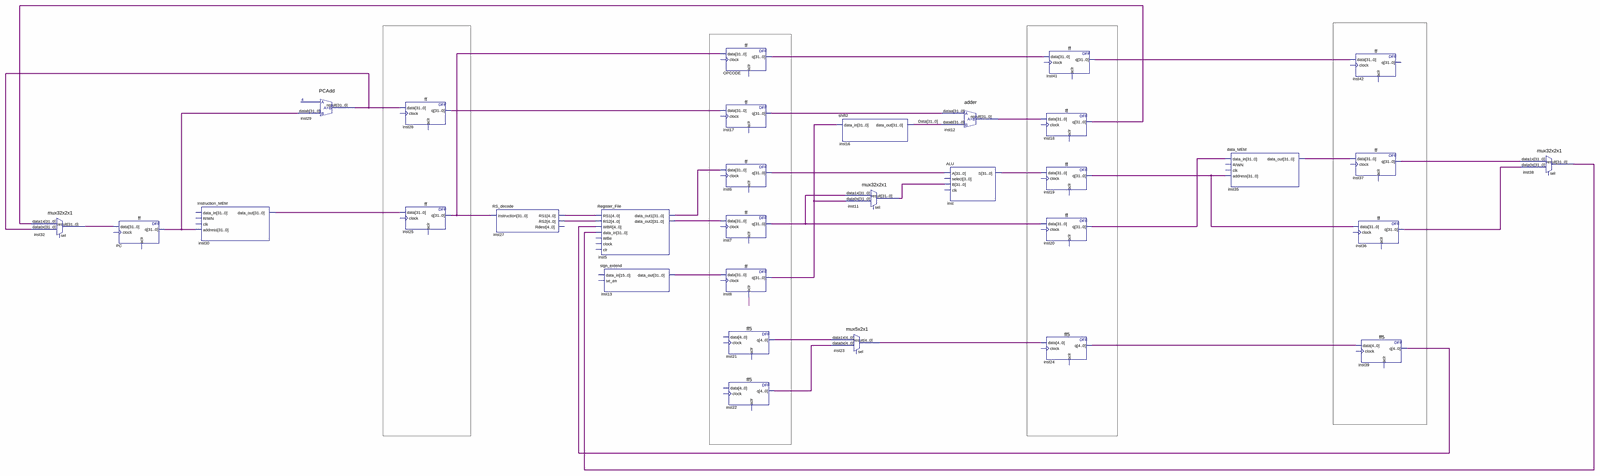
[diagram p0: schematic sheet, whole]
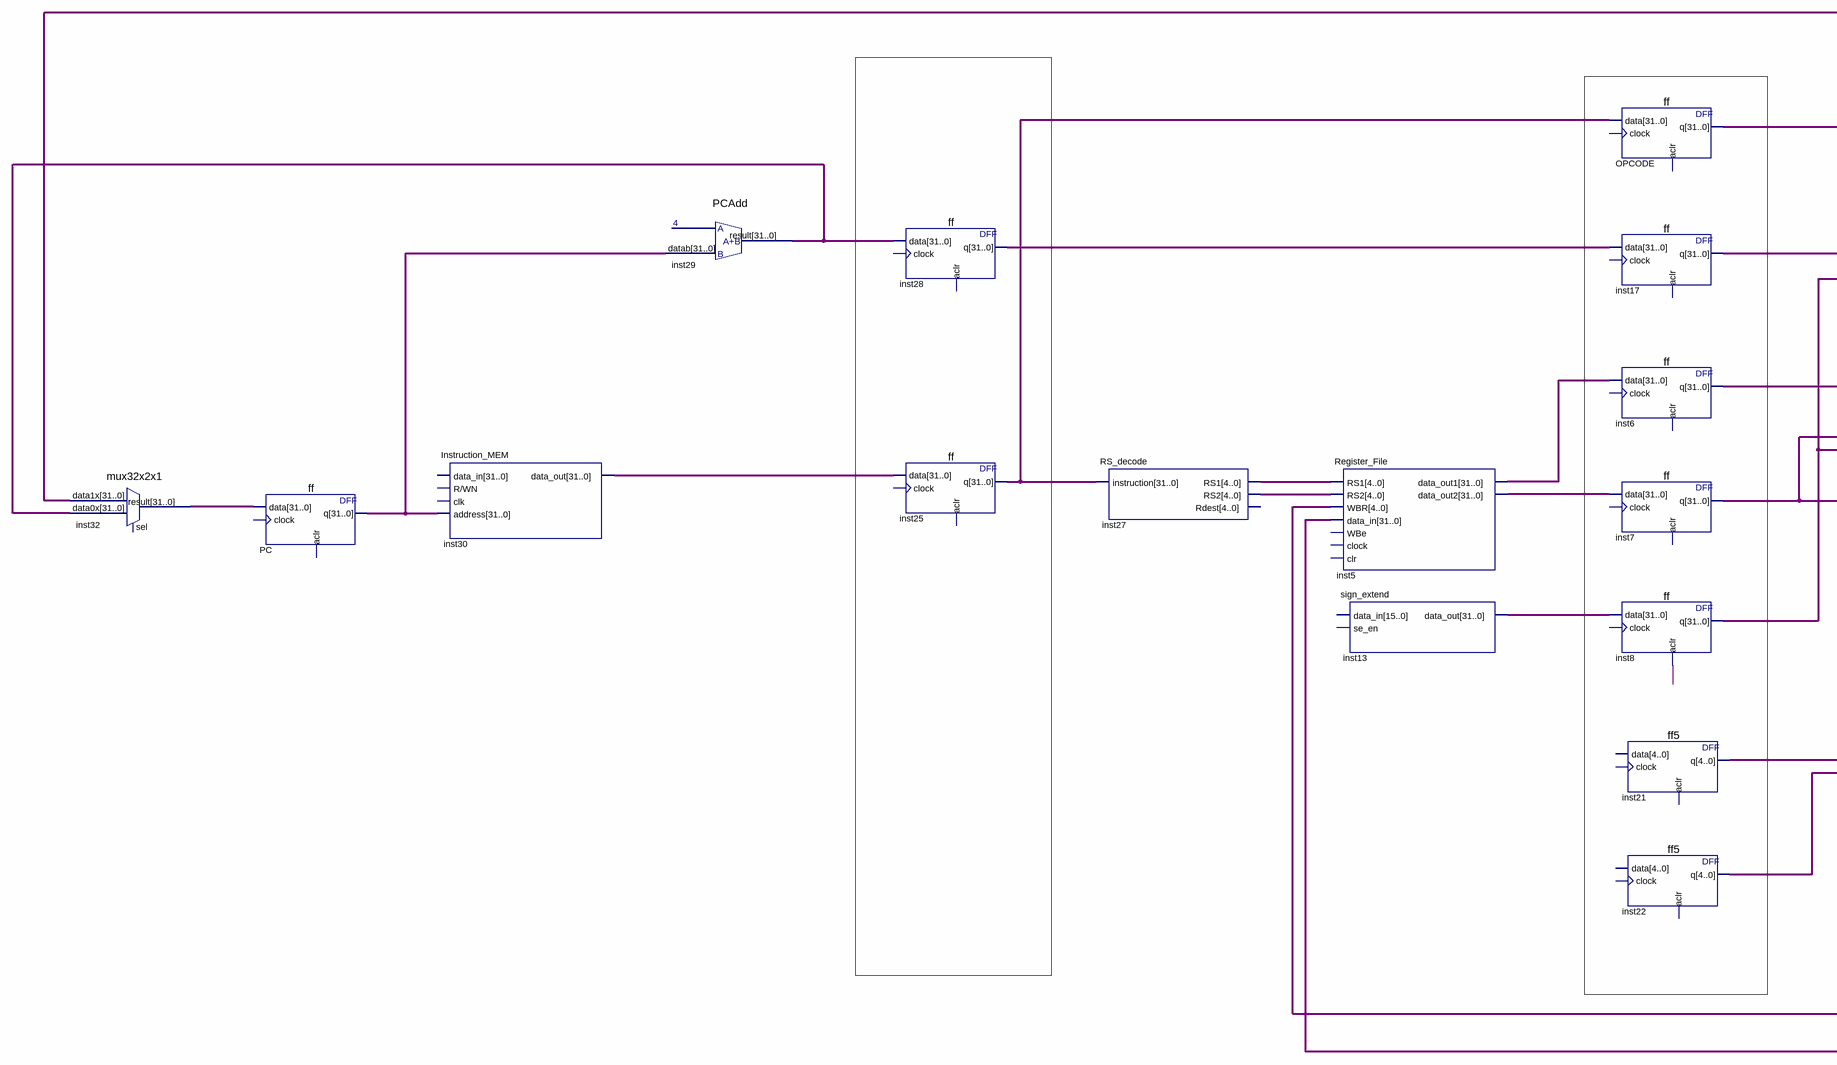
[diagram p1: schematic sheet, left part]
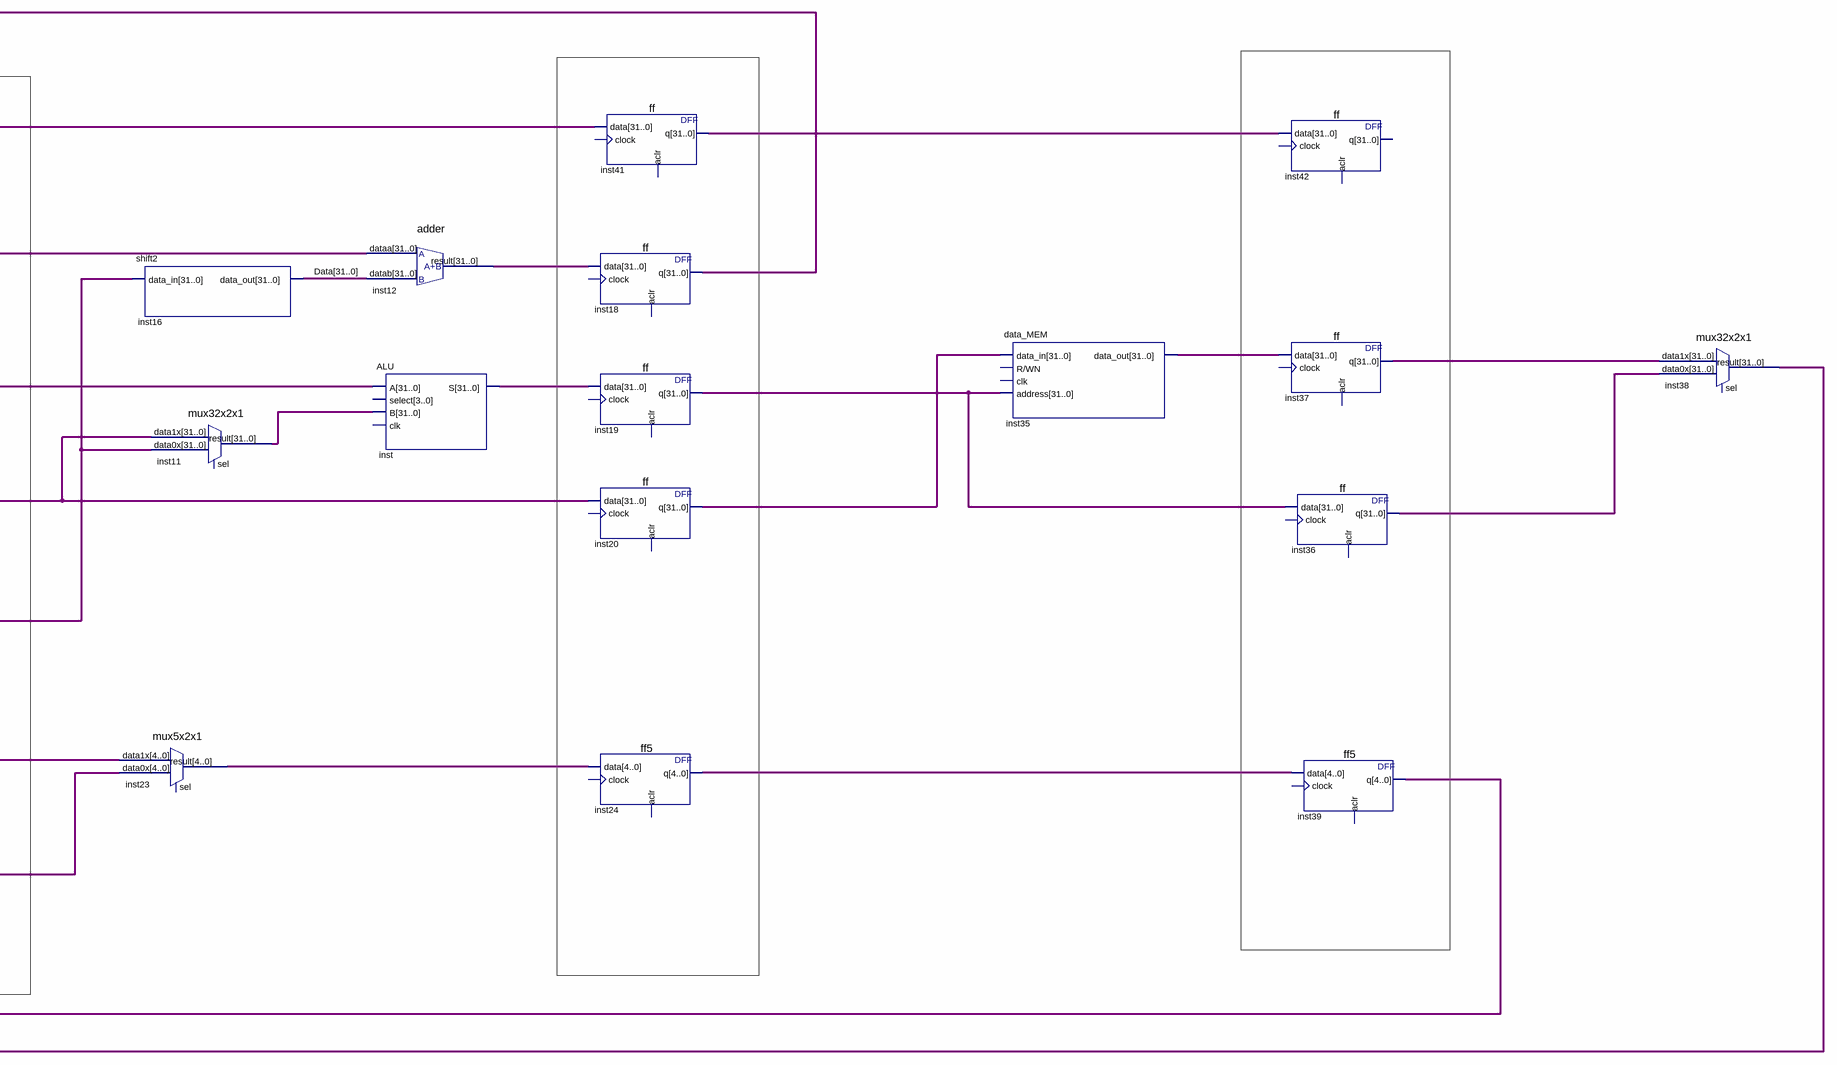
[diagram p2: schematic sheet, right part]
// Quartus schematic CAP.bdf as structural Verilog: 32 symbols, 0 pins
module CAP (
);

  wire undriven;
  wire [4:0] inst21_q, inst22_q, inst23_result, inst24_q, inst27_rs1, inst27_rs2, inst39_q;
  wire [31:0] Data, inst5_data_out1, inst5_data_out2, inst6_q, inst7_q, inst8_q, inst11_result,
       inst12_result, inst13_data_out, inst17_q, inst18_q, inst19_q, inst20_q, inst25_q, inst28_q,
       inst29_result, inst30_data_out, inst32_result, inst35_data_out, inst36_q, inst37_q, inst38_result,
       inst41_q, inst_s, OPCODE_q, PC_q;

  mux32x2x1 inst32 (.data1x(inst18_q), .data0x(inst29_result), .result(inst32_result));  // open: sel
  ff PC (.data(inst32_result), .q(PC_q));  // open: clock, aclr
  Instruction_MEM inst30 (.address(PC_q), .data_out(inst30_data_out));  // open: data_in, R/WN, clk
  PCAdd inst29 (.datab(PC_q), .result(inst29_result));
  ff inst28 (.data(inst29_result), .q(inst28_q));  // open: clock, aclr
  ff inst25 (.data(inst30_data_out), .q(inst25_q));  // open: clock, aclr
  RS_decode inst27 (.instruction(inst25_q), .RS1(inst27_rs1), .RS2(inst27_rs2));  // open: Rdest
  Register_File inst5 (
    .RS1(inst27_rs1), .RS2(inst27_rs2), .WBR(inst39_q), .data_in(inst38_result), .data_out1(inst5_data_out1),
    .data_out2(inst5_data_out2));  // open: WBe, clock, clr
  sign_extend inst13 (.data_out(inst13_data_out));  // open: data_in, se_en
  ff OPCODE (.data(inst25_q), .q(OPCODE_q));  // open: clock, aclr
  ff inst17 (.data(inst28_q), .q(inst17_q));  // open: clock, aclr
  ff inst6 (.data(inst5_data_out1), .q(inst6_q));  // open: clock, aclr
  ff inst7 (.data(inst5_data_out2), .q(inst7_q));  // open: clock, aclr
  ff inst8 (.data(inst13_data_out), .aclr(undriven), .q(inst8_q));  // open: clock
  ff5 inst21 (.q(inst21_q));  // open: data, clock, aclr
  ff5 inst22 (.q(inst22_q));  // open: data, clock, aclr
  shift2 inst16 (.data_in(inst8_q), .data_out(Data));
  mux5x2x1 inst23 (.data1x(inst21_q), .data0x(inst22_q), .result(inst23_result));  // open: sel
  mux32x2x1 inst11 (.data1x(inst7_q), .data0x(inst8_q), .result(inst11_result));  // open: sel
  adder inst12 (.dataa(inst17_q), .datab(Data), .result(inst12_result));
  ALU inst (.A(inst6_q), .B(inst11_result), .S(inst_s));  // open: select, clk
  ff inst41 (.data(OPCODE_q), .q(inst41_q));  // open: clock, aclr
  ff inst18 (.data(inst12_result), .q(inst18_q));  // open: clock, aclr
  ff inst19 (.data(inst_s), .q(inst19_q));  // open: clock, aclr
  ff inst20 (.data(inst7_q), .q(inst20_q));  // open: clock, aclr
  ff5 inst24 (.data(inst23_result), .q(inst24_q));  // open: clock, aclr
  data_MEM inst35 (.data_in(inst20_q), .address(inst19_q), .data_out(inst35_data_out));  // open: R/WN, clk
  ff inst42 (.data(inst41_q));  // open: clock, aclr, q
  ff inst37 (.data(inst35_data_out), .q(inst37_q));  // open: clock, aclr
  ff inst36 (.data(inst19_q), .q(inst36_q));  // open: clock, aclr
  ff5 inst39 (.data(inst24_q), .q(inst39_q));  // open: clock, aclr
  mux32x2x1 inst38 (.data1x(inst37_q), .data0x(inst36_q), .result(inst38_result));  // open: sel
endmodule
